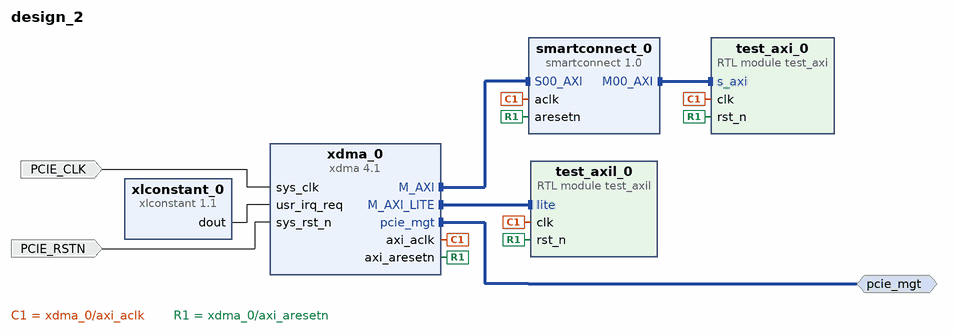
[diagram p0: block diagram of the top level]
# Vivado block design design_2, xc7a200tfbg676-2, Vivado 2022.2
create_bd_design design_2

create_bd_intf_port -mode Master -vlnv xilinx.com:interface:pcie_7x_mgt_rtl:1.0 pcie_mgt
create_bd_port -dir I -type clk PCIE_CLK
create_bd_port -dir I -type rst PCIE_RSTN

create_bd_cell -type ip -vlnv xilinx.com:ip:smartconnect:1.0 smartconnect_0
set_property -dict {CONFIG.NUM_MI 1 CONFIG.NUM_SI 1} [get_bd_cells smartconnect_0]
create_bd_cell -type ip -vlnv xilinx.com:ip:xdma:4.1 xdma_0
set_property -dict [list \
  CONFIG.axilite_master_en true \
  CONFIG.mode_selection Advanced \
  CONFIG.pf0_device_id 7022 \
  CONFIG.pf0_msi_enabled false \
  CONFIG.pl_link_cap_max_link_speed 5.0_GT/s \
  CONFIG.pl_link_cap_max_link_width X2 \
] [get_bd_cells xdma_0]
create_bd_cell -type ip -vlnv xilinx.com:ip:xlconstant:1.1 xlconstant_0
set_property -dict {CONFIG.CONST_VAL 0} [get_bd_cells xlconstant_0]
create_bd_cell -type module -reference test_axi test_axi_0
create_bd_cell -type module -reference test_axil test_axil_0

# ---- connections ----

connect_bd_intf_net [get_bd_intf_pins test_axi_0/s_axi] [get_bd_intf_pins smartconnect_0/M00_AXI]
connect_bd_intf_net [get_bd_intf_pins smartconnect_0/S00_AXI] [get_bd_intf_pins xdma_0/M_AXI]
connect_bd_intf_net [get_bd_intf_pins test_axil_0/lite] [get_bd_intf_pins xdma_0/M_AXI_LITE]
connect_bd_intf_net [get_bd_intf_ports pcie_mgt] [get_bd_intf_pins xdma_0/pcie_mgt]
connect_bd_net -net sys_clk_0_1 [get_bd_ports PCIE_CLK] [get_bd_pins xdma_0/sys_clk]
connect_bd_net -net sys_rst_n_0_1 [get_bd_ports PCIE_RSTN] [get_bd_pins xdma_0/sys_rst_n]
connect_bd_net [get_bd_pins xdma_0/axi_aclk] [get_bd_pins smartconnect_0/aclk] [get_bd_pins test_axi_0/clk] [get_bd_pins test_axil_0/clk]
connect_bd_net [get_bd_pins xdma_0/axi_aresetn] [get_bd_pins smartconnect_0/aresetn] [get_bd_pins test_axi_0/rst_n] [get_bd_pins test_axil_0/rst_n]
connect_bd_net [get_bd_pins xlconstant_0/dout] [get_bd_pins xdma_0/usr_irq_req]

# ---- address map ----
assign_bd_address -offset 0x0000000000000000 -range 16K -target_address_space [get_bd_addr_spaces xdma_0/M_AXI] [get_bd_addr_segs test_axi_0/s_axi/reg0]
assign_bd_address -offset 0x00000000 -range 1M -target_address_space [get_bd_addr_spaces xdma_0/M_AXI_LITE] [get_bd_addr_segs test_axil_0/lite/reg0]

validate_bd_design
save_bd_design
